# Altium schematic sheet USB_Interruptor.SchDoc
size A4
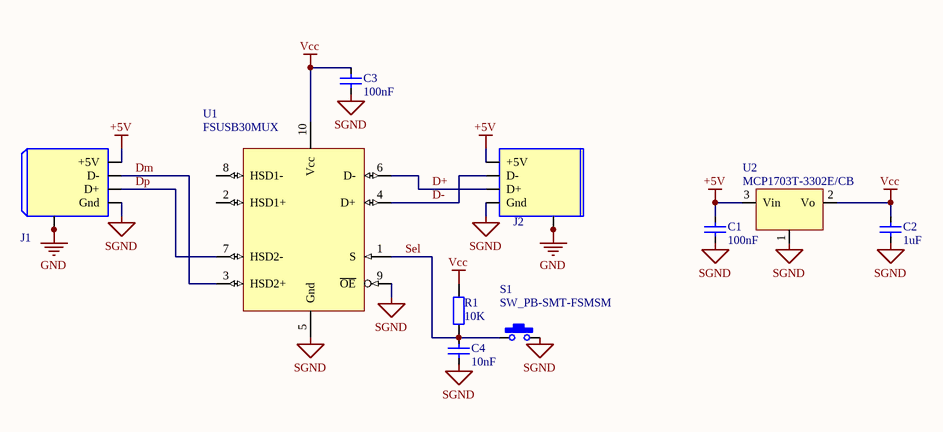
[diagram p0: USB_Interruptor.SchDoc]

## Parts
C1  100nF  [CCNP2012-0805]
C2  1uF  [CCNP2012-0805]
C3  100nF  [CCNP2012-0805]
C4  10nF  [CCNP2012-0805]
J1  USB Type A Plug  [USB_TypeA Plug]  (value not drawn)
J2  USB Type A Socket  [USB-A-Socket]  (value not drawn)
R1  10K  [CR2012-0805]
S1  SW_PB-SMT-FSMSM  [SW_MIN_PB-FSMSM]
U1  FSUSB30MUX  [MSOP-10]
U2  MCP1703T-3302E/CB  [SOT23]

## Nets
+5V: C1.1 J1.5V(+5V) J2.5V(+5V) U2.3(Vin)
GND: J1.Shield1(USBShd) J1.Shield2(USBShd) J2.Shield1(USBShd) J2.Shield2(USBShd)
SGND: C1.2 C2.1 C3.2 C4.2 J1.Gnd J2.Gnd S1.2 U1.5(Gnd) U1.9(~{OE}) U2.1(Gnd)
Vcc: C2.2 C3.1 R1.2 U1.10(Vcc) U2.2(Vo)
D+: J2.D+ U1.6(D-)
D-: J2.D- U1.4(D+)
Dm: J1.D- U1.3(HSD2+)
Dp: J1.D+ U1.7(HSD2-)
Sel: C4.1 R1.1 S1.1 U1.1(S)

Not connected (* = marked no-connect by the designer): U1 2(HSD1+) 8(HSD1-)

## Library data of the parts
C1-C4 = Cap_CCNP_0805: Capacitor SMT 0805; Manufacturer: Generic Components; Class: Passive; Published: 08/06/2000; Publisher: Altium Hobart Technology Centre; SubClass: Capacitor; Farnell PN: *; Digikey: *
  C1 C3: Value: 100nF
  C2: Value: 1uF
  C4: Value: 10nF
J1 = USB_TYPE_A_PLUG: MOLEX 48037-1000; Digikey: *; Farnell PN: 2131387
J2 = USB_TYPE_A_SOCKET: AMPHENOL FCI  87520-0010BLF; Digikey: *; Farnell PN: 1275535
R1 = Res_CR0805: Resistor; Manufacturer: Generic Components; Class: Passive; Published: 08/06/2000; Publisher: Altium Hobart Technology Centre; SubClass: Resistor; Farnell PN: *; Digikey: *; Value: 10K
S1 = SW_PB-SMT-FSMSM: SWITCH, TACTILE SPST 50mA, SMD GULL WING; Manufacturer: Generic Components; Published: 24-Mar-1999; Revision: July-2002: Re-released for DXP Platform.; Publisher: Altium Limited; Digikey: 450-1758-2-ND; Farnell PN: 1703878
U1 = FSUSB30: USB Switch; Farnell PN: 1495465
U2 = MCP1703T-3302E/CB: 3V3 LDO regulator; Farnell PN: 2136813